# EAGLE design pic16 (EAGLE 7.2.0)
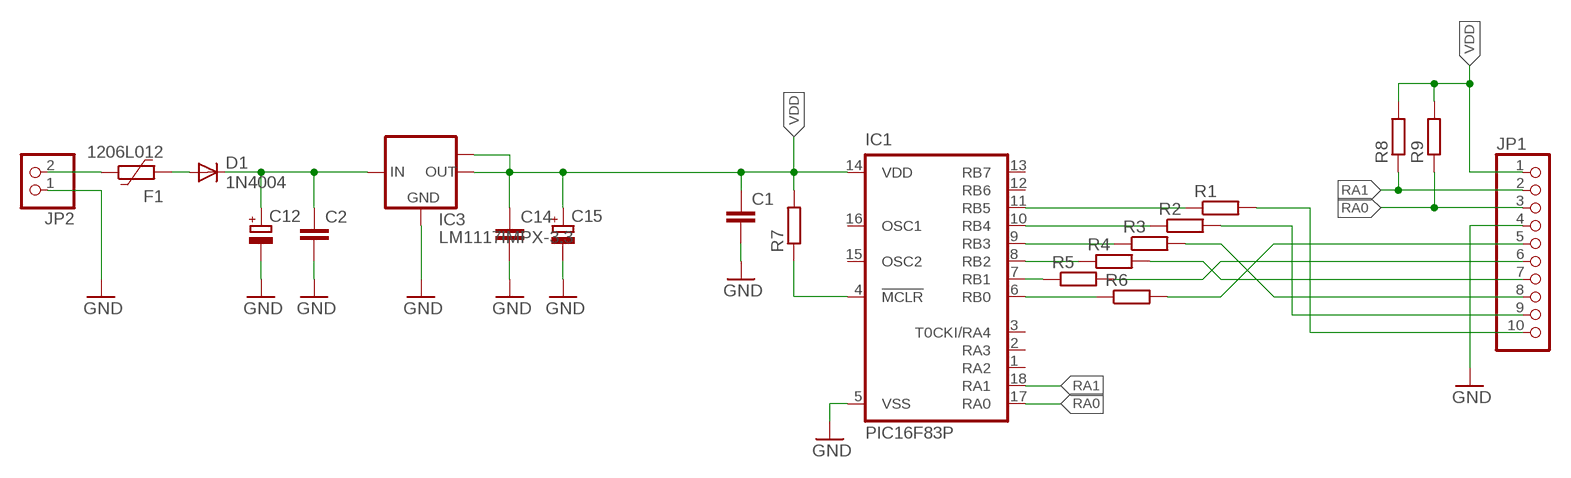
[diagram p0: schematic, sheet 1]

## Parts
C1  C-EUC0603  [C0603]
C2  C-EUC0603  [C0603]
C12  CPOL-EUSMCB  [SMC_B]
C14  C-EUC0603  [C0603]
C15  CPOL-EUSMCB  [SMC_B]
D1  1N4004  [DO41-10]
F1  1206L012  [1206L]
IC1  PIC16F83P  [DIL18]
IC3  LM1117IMPX-3.3  [SOT223]
JP1  PINHD-1X10  [1X10]
JP2  PINHD-1X2  [1X02]
R1  R-EU_R0603  [R0603]
R2  R-EU_R0603  [R0603]
R3  R-EU_R0603  [R0603]
R4  R-EU_R0603  [R0603]
R5  R-EU_R0603  [R0603]
R6  R-EU_R0603  [R0603]
R7  R-EU_R0603  [R0603]
R8  R-EU_0204/5  [0204/5]
R9  R-EU_0204/5  [0204/5]

## Nets
5V: C2.1 C12.+ D1.C IC3.3(IN)
GND: C1.2 C2.2 C12.- C14.2 C15.- IC1.5(VSS) IC3.1(GND) JP1.4 JP2.1
N$1: JP1.8 R3.2
N$2: JP1.7 R4.2
N$3: JP1.6 R5.2
N$4: JP1.5 R6.2
N$5: JP1.9 R2.2
N$6: JP1.10 R1.2
N$7: IC1.11(RB5) R1.1
N$8: IC1.10(RB4) R2.1
N$9: IC1.9(RB3) R3.1
N$10: IC1.8(RB2) R4.1
N$11: IC1.7(RB1) R5.1
N$12: IC1.6(RB0) R6.1
N$13: IC1.4(!MCLR) R7.1
N$14: F1.1 JP2.2
N$15: D1.A F1.2
RA0: IC1.17(RA0) JP1.3 R9.1
RA1: IC1.18(RA1) JP1.2 R8.1
VDD: C1.1 C14.1 C15.+ IC1.14(VDD) IC3.2(OUT) IC3.TAB(OUT1) JP1.1 R7.2 R8.2 R9.2
Unconnected: IC1.1(RA2) IC1.2(RA3) IC1.3(T0CKI/RA4) IC1.12(RB6) IC1.13(RB7) IC1.15(OSC2) IC1.16(OSC1)

## Library data of the parts
C1 C2 C14 = rcl:C-EU: CAPACITOR, European symbol
C12 C15 = rcl:CPOL-EU: POLARIZED CAPACITOR, European symbol
D1 = adafruit:1N4004: DIODE General purpose 1N400x type rectifier (With bigger pads) http://www.ladyada.net/library/pcb/eaglelibrary.html
F1 = polyfuse-smd_10:?: Polyfuse Resettable PTC Source: http://www.littelfuse.com/products/resettable-ptcs.aspx; MF: Littelfuse; MPN: 1206L012; OC_FARNELL: 1596988; OC_NEWARK: 05M2298
IC1 = microchip:PIC16F8*: MICROCONTROLLER 8-Bit PIC16F8X Family - CMOS Flash/EEPROM Pin Compatible : PIC16F83, PIC16CR83, PIC16F84A, PIC16CR84 see also PIC16C* <DEVICE:PIC16C*>; MPN: PIC16F83-04/P; OC_FARNELL: 1084354; OC_NEWARK: 97K7388
IC3 = lm1117:LM1117IMPX-*
JP1 = pinhead:PINHD-1X10: PIN HEADER
JP2 = pinhead:PINHD-1X2: PIN HEADER
R1-R9 = rcl:R-EU_: RESISTOR, European symbol

## Board
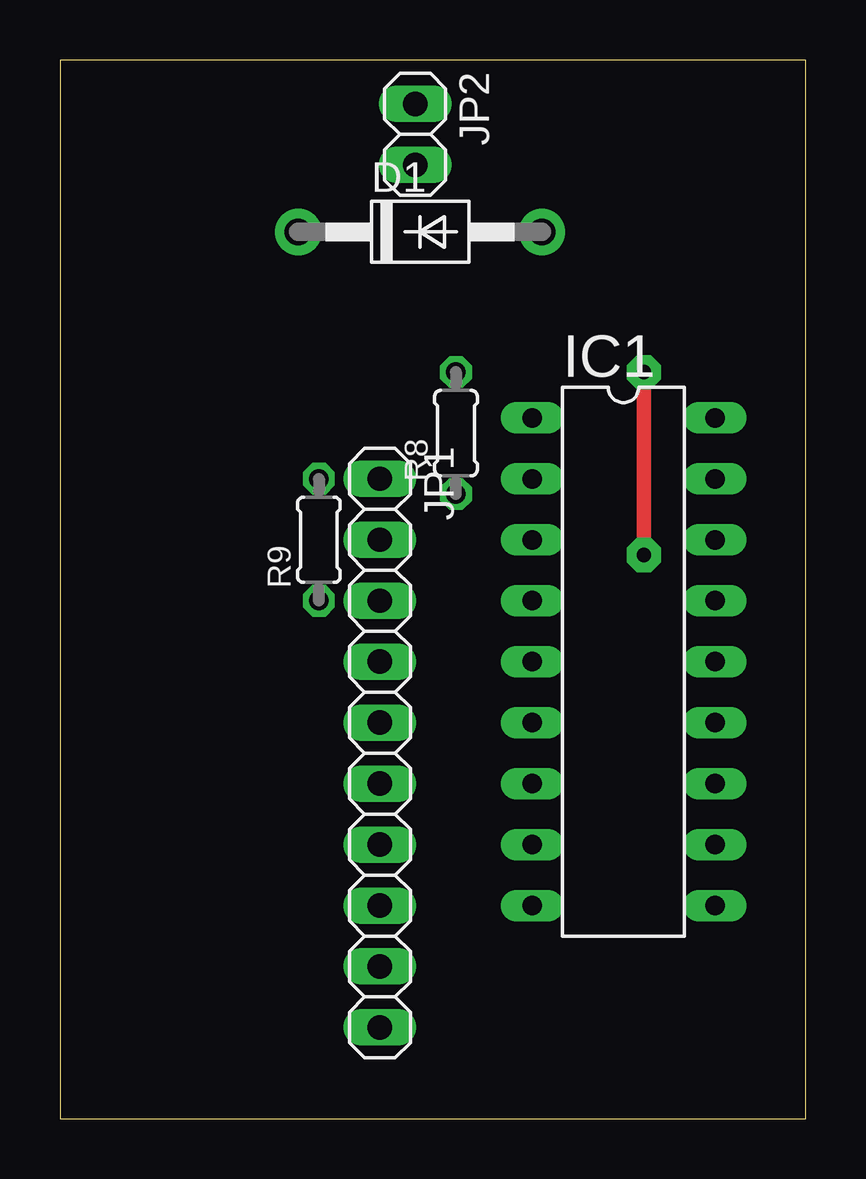
[diagram p1: board, top side]
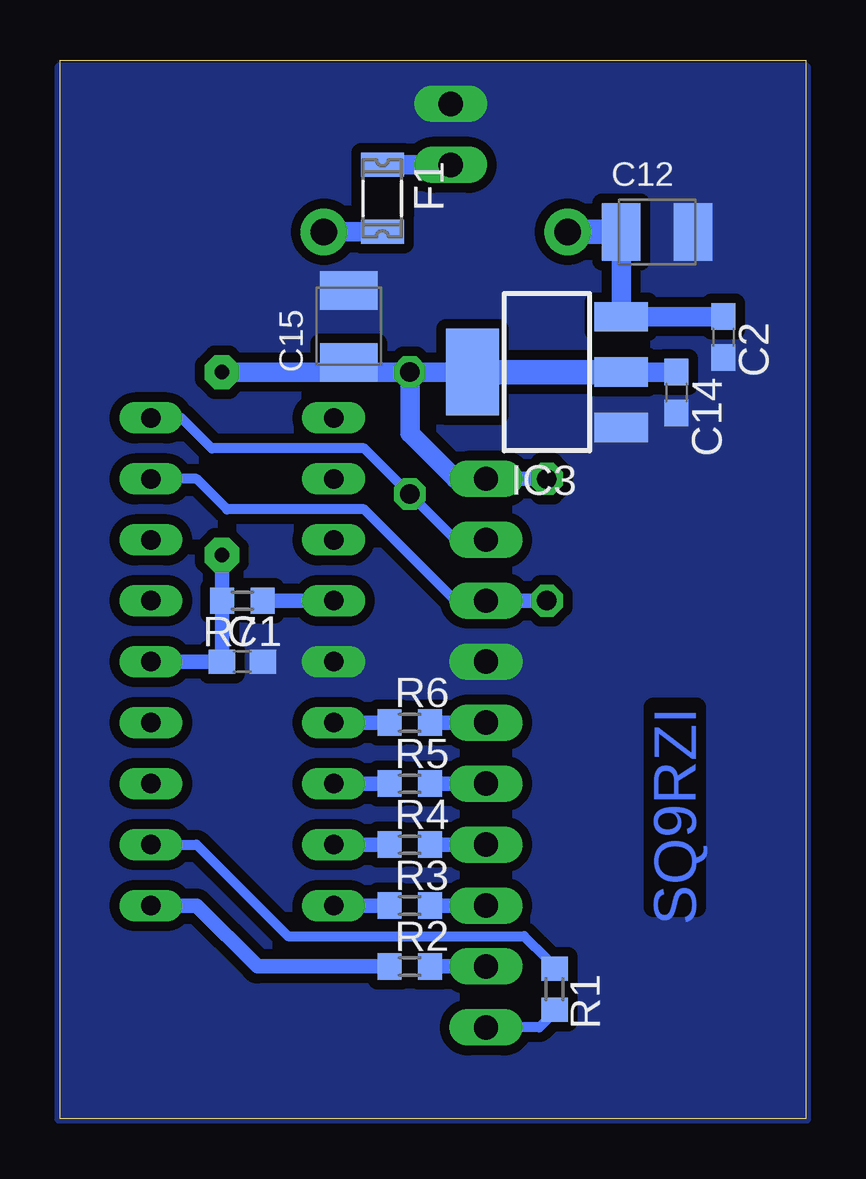
[diagram p2: board, bottom side, seen from below]

Size 31.09 x 44.12 mm. Coordinates in mm from the lower left corner, seen from the top.
Outline: 0,0 31.09,0 31.09,44.12 0,44.12 0,0
Copper layers (1*16): Top 0.035mm / dielectric 1.5mm / Bottom 0.035mm
Design rules "default *": minimum track width 10mil, minimum drill 24mil, track to track 8mil, track to pad 8mil, pad to pad 8mil, via to via 8mil, smd to smd 8mil, copper to edge 0mil, drill to drill 8mil, minimum pad ring 10mil, minimum via ring 8mil, stop-mask expansion 4mil, vias tented up to drill 0mil, thermal gap 10mil
bRestrict: area 16.7,37.7 to 18.5,39

### Footprints (pad centres in the part's own frame; a part is rotated, then mirrored left to right if it is on the bottom)
C0603 = smd 1.1 x 1: 1 -0.85,0; 2 0.85,0
SMC_B = smd 1.6 x 2.4: + -1.5,0; - 1.5,0
DO41-10 = drill 1.118 pad 1.93: A 5.08,0; C -5.08,0
1206L = smd 1 x 1.8: 1 -1.4,0; 2 1.4,0
DIL18 = drill 0.813 long: 1 -10.16,-3.81; 2 -7.62,-3.81; 3 -5.08,-3.81; 4 -2.54,-3.81; 5 0,-3.81; 6 2.54,-3.81; 7 5.08,-3.81; 8 7.62,-3.81; 9 10.16,-3.81; 10 10.16,3.81; 11 7.62,3.81; 12 5.08,3.81; 13 2.54,3.81; 14 0,3.81; 15 -2.54,3.81; 16 -5.08,3.81; 17 -7.62,3.81; 18 -10.16,3.81
SOT223 = smd 1.219 x 2.235: 1 -2.311,-3.099; 2 0,-3.099; 3 2.311,-3.099 | smd 3.6 x 2.2: TAB 0,3.099
1X10 = drill 1.016 long: 1 -11.43,0; 2 -8.89,0; 3 -6.35,0; 4 -3.81,0; 5 -1.27,0; 6 1.27,0; 7 3.81,0; 8 6.35,0; 9 8.89,0; 10 11.43,0
1X02 = drill 1.016 long: 1 -1.27,0; 2 1.27,0
R0603 = smd 1 x 1.1: 1 -0.85,0; 2 0.85,0
0204/5 = drill 0.813 octagon: 1 -2.54,0; 2 2.54,0

### Placement (x,y rotation side)
C1  23.49,19.05 0 bottom
C2  3.44,32.58 270 bottom
C12  6.2,36.96 0 bottom
C14  5.4,30.26 270 bottom
C15  19.05,33.02 90 bottom
D1  15.01,36.96 0 top
F1  17.65,38.35 270 bottom
IC1  23.49,19.05 270 top
IC3  10.79,31.11 90 bottom
JP1  13.34,15.24 270 top
JP2  14.81,41.02 270 top
R1  10.48,5.4 270 bottom
R2  16.51,6.35 0 bottom
R3  16.51,8.89 0 bottom
R4  16.51,11.43 0 bottom
R5  16.51,13.97 0 bottom
R6  16.51,16.51 0 bottom
R7  23.49,21.59 180 bottom
R8  16.51,28.57 90 top
R9  10.79,24.13 90 top

### Tracks (layer width: path | path; a pad name or v marks a point on that pad's centre or on a via)
5V
  Bottom 0.813: C2.1 IC3.3 C12.+
  Bottom 1.016: C12.+ D1.C
GND
  pour Bottom (isolate 0.406, no thermals): 0,43.81 0,0 31.12,0 31.12,43.81
N$1
  Bottom 0.61: JP1.8 R3.2
N$2
  Bottom 0.61: JP1.7 R4.2
N$3
  Bottom 0.61: JP1.6 R5.2
N$4
  Bottom 0.61: JP1.5 R6.2
N$5
  Bottom 0.61: JP1.9 R2.2
N$6
  Bottom 0.406: 12.38,3.81 JP1.10 11.11,3.81 10.48,4.45 R1.2
N$7
  Bottom 0.406: IC1.11 25.4,11.43 21.59,7.62 11.75,7.62 10.79,6.67 10.79,6.57 R1.1
N$8
  Bottom 0.61: R2.1 22.86,6.35 25.4,8.89 IC1.10
N$9
  Bottom 0.61: R3.1 IC1.9
N$10
  Bottom 0.61: R4.1 IC1.8
N$11
  Bottom 0.61: R5.1 IC1.7
N$12
  Bottom 0.61: R6.1 IC1.6
N$13
  Bottom 0.61: IC1.4 R7.1
N$14
  Bottom 0.813: JP2.2 F1.1
N$15
  Bottom 0.813: F1.2 D1.A
RA0
  Bottom 0.406: IC1.17 25.4,26.67 24.13,25.4 18.41,25.4 14.61,21.59 JP1.3
  Bottom 0.61: R9.1 JP1.3
RA1
  Bottom 0.406: IC1.18 26.04,29.21 24.77,27.94 18.41,27.94 R8.1 14.61,24.13 JP1.2
VDD  (via drill 0.6 pad 1.42)
  Top 0.61: v24.34,31.11 v24.34,23.5
  Bottom 0.406: C15.+ 19.05,31.11
  Bottom 0.61: R9.2 JP1.1 | IC1.14 C1.1 R7.2 v24.34,23.5
  Bottom 0.813: R8.2 16.51,28.57 14.61,26.67 JP1.1 | R8.2 19.05,31.11 v24.34,31.11 | IC3.TAB R8.2 | C14.1 IC3.2
  Bottom 1.016: IC3.2 IC3.TAB

### Text on the board
Bottom: SQ9RZI